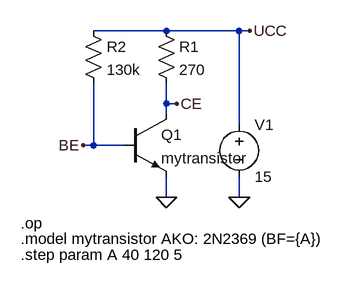
[diagram p0: schematic uklad polaryzacji stalopradowej ze stalym pradem bazy_lista3.asc]
uklad polaryzacji stalopradowej ze stalym pradem bazy_lista3.asc, the LTspice schematic file:
Version 4.1
SHEET 1 880 680
WIRE 208 -48 96 -48
WIRE 320 -48 208 -48
WIRE 336 -48 320 -48
WIRE 208 64 208 32
WIRE 224 64 208 64
WIRE 208 80 208 64
WIRE 320 96 320 -48
WIRE 96 128 96 32
WIRE 96 128 80 128
WIRE 144 128 96 128
WIRE 208 208 208 176
WIRE 320 208 320 176
FLAG 320 208 0
FLAG 208 208 0
FLAG 80 128 BE
FLAG 336 -48 UCC
FLAG 224 64 CE
SYMBOL npn 144 80 R0
SYMATTR InstName Q1
SYMATTR Value mytransistor
SYMBOL res 192 -64 R0
SYMATTR InstName R1
SYMATTR Value 270
SYMBOL res 80 -64 R0
SYMATTR InstName R2
SYMATTR Value 130k
SYMBOL voltage 320 80 R0
WINDOW 123 0 0 Left 0
WINDOW 39 0 0 Left 0
SYMATTR InstName V1
SYMATTR Value 15
TEXT -16 248 Left 2 !.op
TEXT -16 272 Left 2 !.model mytransistor AKO: 2N2369 (BF={A})
TEXT -16 296 Left 2 !.step param A 40 120 5

The netlist it stands for:
* uklad polaryzacji stalopradowej ze stalym pradem bazy_lista3.asc
Q1 CE BE 0 0 mytransistor
R1 UCC CE 270
R2 UCC BE 130k
V1 UCC 0 15
.model NPN NPN
.model PNP PNP
.lib standard.bjt
.op
.model mytransistor AKO: 2N2369 (BF={A})
.step param A 40 120 5
.backanno
.end